# EAGLE schematic CAN_Wake_Up (EAGLE 9.2.2)
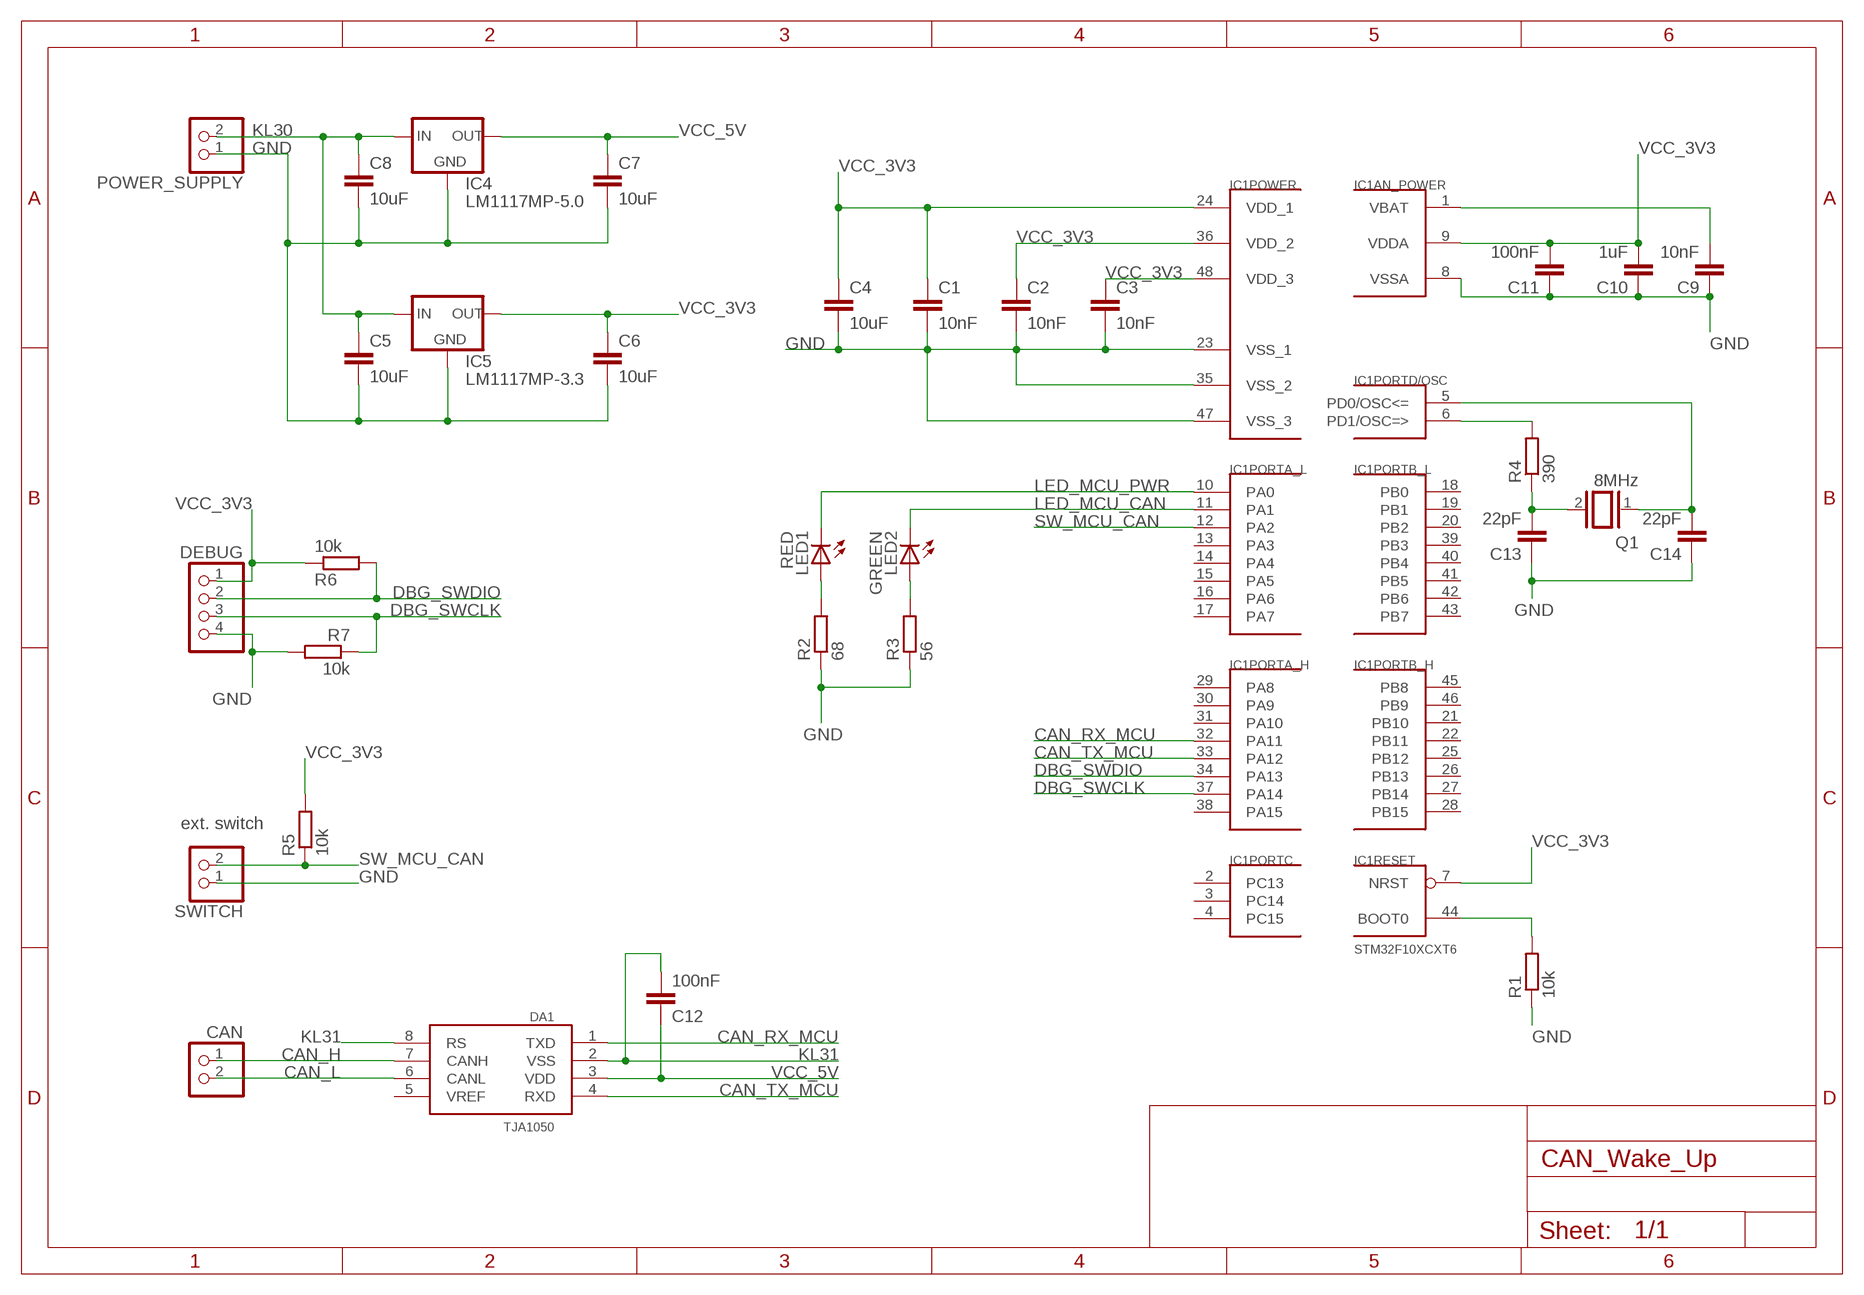
[diagram p0: schematic, sheet 1]

## Parts
C1  10nF  C-EUC0805  [C0805]
C2  10nF  C-EUC0805  [C0805]
C3  10nF  C-EUC0805  [C0805]
C4  10uF  C-EUC0805  [C0805]
C5  10uF  C-EUC0805  [C0805]
C6  10uF  C-EUC0805  [C0805]
C7  10uF  C-EUC0805  [C0805]
C8  10uF  C-EUC0805  [C0805]
C9  10nF  C-EUC0805  [C0805]
C10  1uF  C-EUC0805  [C0805]
C11  100nF  C-EUC0805  [C0805]
C12  100nF  C-EUC0805  [C0805]
C13  22pF  C-EUC0805  [C0805]
C14  22pF  C-EUC0805  [C0805]
CAN  PINHD-1X2  [1X02]
DA1  TJA1050  [SO08]
DEBUG  PINHD-1X4  [1X04]
IC1  STM32F10XCXT6  [TQFP48]
IC4  LM1117MP-5.0  [SOT223]
IC5  LM1117MP-3.3  [SOT223]
LED1  RED  LED3MM  [LED3MM]
LED2  GREEN  LED3MM  [LED3MM]
POWER_SUPPLY  PINHD-1X2  [1X02]
Q1  8MHz  XTAL  [Q]
R1  10k  R-EU_R0805  [R0805]
R2  68  R-EU_R0805  [R0805]
R3  56  R-EU_R0805  [R0805]
R4  390  R-EU_R0805  [R0805]
R5  10k  R-EU_R0805  [R0805]
R6  10k  R-EU_R0805  [R0805]
R7  10k  R-EU_R0805  [R0805]
SWITCH  PINHD-1X2  [1X02]

## Nets
CAN_H: CAN.1 DA1.7(CANH)
CAN_L: CAN.2 DA1.6(CANL)
CAN_RX_MCU: DA1.1(TXD) IC1.32(PORTA_H:PA11)
CAN_TX_MCU: DA1.4(RXD) IC1.33(PORTA_H:PA12)
DBG_SWCLK: DEBUG.3 IC1.37(PORTA_H:PA14) R7.1
DBG_SWDIO: DEBUG.2 IC1.34(PORTA_H:PA13) R6.2
GND: C1.2 C2.2 C3.2 C4.2 C5.2 C6.2 C7.2 C8.2 C9.1 C10.1 C11.1 C13.1 C14.1 DEBUG.4 IC1.8(AN_POWER:VSSA) IC1.23(POWER:VSS_1) IC1.35(POWER:VSS_2) IC1.47(POWER:VSS_3) IC4.1(GND) IC5.1(GND) POWER_SUPPLY.1 R1.1 R2.1 R3.1 R7.2 SWITCH.1
KL30: C5.1 C8.1 IC4.3(IN) IC5.3(IN) POWER_SUPPLY.2
KL31: C12.2 DA1.2(VSS) DA1.8(RS)
LED_MCU_CAN: IC1.11(PORTA_L:PA1) LED2.K(C)
LED_MCU_PWR: IC1.10(PORTA_L:PA0) LED1.K(C)
N$1: IC1.44(RESET:BOOT0) R1.2
N$2: C9.2 IC1.1(AN_POWER:VBAT)
N$3: LED1.A R2.2
N$4: LED2.A R3.2
N$5: C13.2 Q1.2 R4.1
N$6: C14.2 IC1.5(PORTD/OSC:PD0/OSC<=) Q1.1
N$7: IC1.6(PORTD/OSC:PD1/OSC=>) R4.2
SW_MCU_CAN: IC1.12(PORTA_L:PA2) R5.1 SWITCH.2
VCC_3V3: C1.1 C2.1 C3.1 C4.1 C6.1 C10.2 C11.2 DEBUG.1 IC1.7(RESET:NRST) IC1.9(AN_POWER:VDDA) IC1.24(POWER:VDD_1) IC1.36(POWER:VDD_2) IC1.48(POWER:VDD_3) IC5.2(OUT) IC5.4(OUT) R5.2 R6.1
VCC_5V: C7.1 C12.1 DA1.3(VDD) IC4.2(OUT) IC4.4(OUT)
Unconnected: DA1.5(VREF) IC1.2(PORTC:PC13) IC1.3(PORTC:PC14) IC1.4(PORTC:PC15) IC1.13(PORTA_L:PA3) IC1.14(PORTA_L:PA4) IC1.15(PORTA_L:PA5) IC1.16(PORTA_L:PA6) IC1.17(PORTA_L:PA7) IC1.18(PORTB_L:PB0) IC1.19(PORTB_L:PB1) IC1.20(PORTB_L:PB2) IC1.21(PORTB_H:PB10) IC1.22(PORTB_H:PB11) IC1.25(PORTB_H:PB12) IC1.26(PORTB_H:PB13) IC1.27(PORTB_H:PB14) IC1.28(PORTB_H:PB15) IC1.29(PORTA_H:PA8) IC1.30(PORTA_H:PA9) IC1.31(PORTA_H:PA10) IC1.38(PORTA_H:PA15) IC1.39(PORTB_L:PB3) IC1.40(PORTB_L:PB4) IC1.41(PORTB_L:PB5) IC1.42(PORTB_L:PB6) IC1.43(PORTB_L:PB7) IC1.45(PORTB_H:PB8) IC1.46(PORTB_H:PB9)

## Notes on the sheet
- ext. switch

## Library data of the parts
C1-C14 = rcl:C-EU: CAPACITOR, European symbol
CAN POWER_SUPPLY SWITCH = pinhead:PINHD-1X2: PIN HEADER
DA1 = CAN_Driver:TJA1050: High speed CAN transceiver Input levels compatible with 3.3 V and 5 V devices 5V supply
DEBUG = pinhead:PINHD-1X4: PIN HEADER
IC1 = stm32:STM32F10XCXT6: ST STM32F101/103 48pin LQFP
IC4 = lm1117_11:LM1117?-*: 800mA Low-Dropout Linear Regulator Source: http://www.ti.com/lit/ds/symlink/lm1117-n.pdf; MF: Texas Instruments; MPN: LM1117MP-5.0; OC_FARNELL: 9778209; OC_NEWARK: 28X3417
IC5 = lm1117_11:LM1117?-*: 800mA Low-Dropout Linear Regulator Source: http://www.ti.com/lit/ds/symlink/lm1117-n.pdf; MF: Texas Instruments; MPN: LM1117MP-3.3; OC_FARNELL: 9778195; OC_NEWARK: 28X3416
LED1 LED2 = led:LED: LED OSRAM: - CHIPLED LG R971, LG N971, LY N971, LG Q971, LY Q971, LO R971, LY R971 LH N974, LH R974 LS Q976, LO Q976, LY Q976 LO Q996 - Hyper CHIPLED LW Q18S LB Q993, LB Q99A, LB R99A - SideLED LS A670, LO A670, LY A670, LG A670, LP A670 LB A673, LV A673, LT A673, LW A673 LH A674 LY A675 LS A676, LA A676, LO A676, LY A676, LW A676 LS A679, LY A679, LG A679 - Hyper Micro SIDELED® LS Y876, LA Y876, LO Y876, LY Y876 LT Y87S - SmartLED LW L88C, LW L88S LB L89C, LB L89S, LG L890 LS L89K, LO L89K, LY L89K LS L896, LA L896, LO L896, LY L896 - TOPLED LS T670, LO T670, LY T670, LG T670, LP T670 LSG T670, LSP T670, LSY T670, LOP T670, LYG T670 LG T671, LOG T671, LSG T671 LB T673, LV T673, LT T673, LW T673 LH T674 LS T676, LA T676, LO T676, LY T676, LB T676, LH T676, LSB T676, LW T676 LB T67C, LV T67C, LT T67C, LS T67K, LO T67K, LY T67K, LW E67C LS E67B, LA E67B, LO E67B, LY E67B, LB E67C, LV E67C, LT E67C LW T67C LS T679, LY T679, LG T679 LS T770, LO T770, LY T770, LG T770, LP T770 LB T773, LV T773, LT T773, LW T773 LH T774 LS E675, LA E675, LY E675, LS T675 LS T776, LA T776, LO T776, LY T776, LB T776 LHGB T686 LT T68C, LB T68C - Hyper Mini TOPLED® LB M676 - Mini TOPLED Santana® LG M470 LS M47K, LO M47K, LY M47K Source: http://www.osram.convergy.de LUXEON: - LUMILED® LXK2-PW12-R00, LXK2-PW12-S00, LXK2-PW14-U00, LXK2-PW14-V00 LXK2-PM12-R00, LXK2-PM12-S00, LXK2-PM14-U00 LXK2-PE12-Q00, LXK2-PE12-R00, LXK2-PE12-S00, LXK2-PE14-T00, LXK2-PE14-U00 LXK2-PB12-K00, LXK2-PB12-L00, LXK2-PB12-M00, LXK2-PB14-N00, LXK2-PB14-P00, LXK2-PB14-Q00 LXK2-PR12-L00, LXK2-PR12-M00, LXK2-PR14-Q00, LXK2-PR14-R00 LXK2-PD12-Q00, LXK2-PD12-R00, LXK2-PD12-S00 LXK2-PH12-R00, LXK2-PH12-S00 LXK2-PL12-P00, LXK2-PL12-Q00, LXK2-PL12-R00 Source: www.luxeon.com KINGBRIGHT: KA-3528ASYC Source: www.kingbright.com
Q1 = special:XTAL: CRYSTAL
R1-R7 = rcl:R-EU_: RESISTOR, European symbol